# Altium project AD5541.PrjPcb
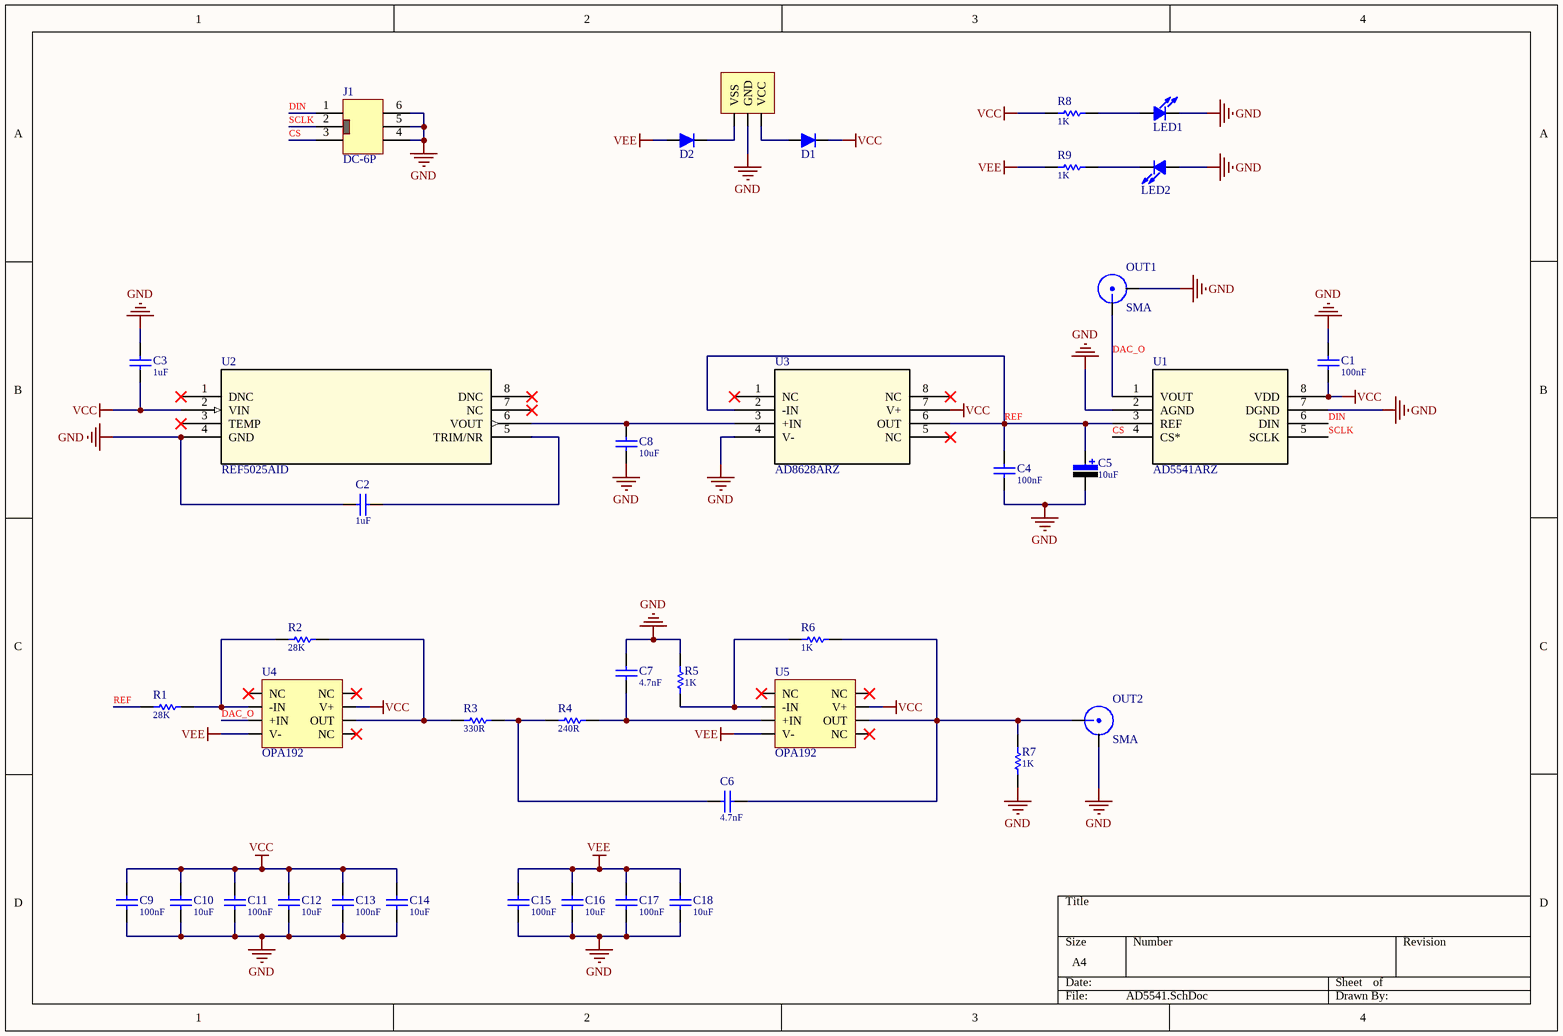
[diagram p0: AD5541.SchDoc]
1 sheet, 40 parts. Net scope: global (net labels, ports and power ports of the same name join across sheets).
Board file: AD5541.PcbDoc

## Sheet AD5541.SchDoc
size A4

### Parts
C1  value 100nF  [C0603-L]  (hidden comment: Cap-S)
C2  value 1uF  [C0603-L]  (hidden comment: Cap-S)
C3  value 1uF  [C0603-L]  (hidden comment: Cap-S)
C4  value 100nF  [C0603-L]  (hidden comment: Cap-S)
C5  value 10uF  [C-DIP-8]  (hidden comment: C)
C6  value 4.7nF  [C0603-L]  (hidden comment: Cap-S)
C7  value 4.7nF  [C0603-L]  (hidden comment: Cap-S)
C8  value 10uF  [C0603-L]  (hidden comment: Cap-S)
C9  value 100nF  [C0603-L]  (hidden comment: Cap-S)
C10  value 10uF  [C0603-L]  (hidden comment: Cap-S)
C11  value 100nF  [C0603-L]  (hidden comment: Cap-S)
C12  value 10uF  [C0603-L]  (hidden comment: Cap-S)
C13  value 100nF  [C0603-L]  (hidden comment: Cap-S)
C14  value 10uF  [C0603-L]  (hidden comment: Cap-S)
C15  value 100nF  [C0603-L]  (hidden comment: Cap-S)
C16  value 10uF  [C0603-L]  (hidden comment: Cap-S)
C17  value 100nF  [C0603-L]  (hidden comment: Cap-S)
C18  value 10uF  [C0603-L]  (hidden comment: Cap-S)
D1  D  [D-SMA]  (value not drawn)
D2  D  [D-SMA]  (value not drawn)
J1  DC-6P  [DC-6P]
J2  Power-3P  [SIPA03]  (value not drawn)
LED1  LED  [Led-0805_L]  (value not drawn)
LED2  LED  [Led-0805_L]  (value not drawn)
OUT1  SMA  [SMA1]
OUT2  SMA  [SMA1]
R1  value 28K  [R0603-L]  (hidden comment: R)
R2  value 28K  [R0603-L]  (hidden comment: R)
R3  value 330R  [R0603-L]  (hidden comment: R)
R4  value 240R  [R0603-L]  (hidden comment: R)
R5  value 1K  [R0603-L]  (hidden comment: R)
R6  value 1K  [R0603-L]  (hidden comment: R)
R7  value 1K  [R0603-L]  (hidden comment: R)
R8  value 1K  [R0603-L]  (hidden comment: R)
R9  value 1K  [R0603-L]  (hidden comment: R)
U1  AD5541ARZ  [R_8_ADI]
U2  REF5025AID  [D8]
U3  AD8628ARZ  [R_8_ADI]
U4  OPA192  [SOIC127P600X175-8N]
U5  OPA192  [SOIC127P600X175-8N]

### Nets
GND: C1.2 C2.1 C3.2 C4.1 C5.2 C7.2 C8.1 C9.1 C10.1 C11.1 C12.1 C13.1 C14.1 C15.1 C16.1 C17.1 C18.1 J1.4 J1.5 J1.6 J2.2(GND) LED1.2 LED2.1 OUT1.2 OUT2.2 R5.1 R7.1 U1.2(AGND) U1.7(DGND) U2.4(GND) U3.4(V-)
VCC: C1.1 C3.1 C9.2 C10.2 C11.2 C12.2 C13.2 C14.2 D1.2 R8.1 U1.8(VDD) U2.2(VIN) U3.7(V+) U4.7(V+) U5.7(V+)
VEE: C15.2 C16.2 C17.2 C18.2 D2.1 R9.1 U4.4(V-) U5.4(V-)
CS: J1.3 U1.4(CS*)
DAC_O: OUT1.1 U1.1(VOUT) U4.3(+IN)
DIN: J1.1 U1.6(DIN)
REF: C4.2 C5.1 R1.1 U1.3(REF) U3.2(-IN) U3.6(OUT)
SCLK: J1.2 U1.5(SCLK)
NetC2_2: C2.2 U2.5(TRIM/NR)
NetC6_1: C6.1 R3.2 R4.1
NetC6_2: C6.2 OUT2.1 R6.2 R7.2 U5.6(OUT)
NetC7_1: C7.1 R4.2 U5.3(+IN)
NetC8_2: C8.2 U2.6(VOUT) U3.3(+IN)
NetD1_1: D1.1 J2.1(VCC)
NetD2_2: D2.2 J2.3(VSS)
NetLED1_1: LED1.1 R8.2
NetLED2_2: LED2.2 R9.2
NetR1_2: R1.2 R2.1 U4.2(-IN)
NetR2_2: R2.2 R3.1 U4.6(OUT)
NetR5_2: R5.2 R6.1 U5.2(-IN)

Not connected (* = marked no-connect by the designer): U2 1(DNC)* 3(TEMP)* 7(NC)* 8(DNC)*; U3 1(NC)* 5(NC)* 8(NC)*; U4 1(NC)* 5(NC)* 8(NC)*; U5 1(NC)* 5(NC)* 8(NC)*

### Library data of the parts
C1-C4 C6-C18 = Cap-S: 贴片瓷片电容
C5 = Cap-Pol-ER: 极性直插电解电容
D1 D2 = Diode: 二极管
J2 = Power-3P: 供电端子
LED1 LED2 = LED: 发光二极管
R1-R9 = Res: 贴片电阻
U1 = AD5541ARZ: No Description Available; Mfr_Name: Analog Devices Inc; Copyright: Copyright (C) 2021 Ultra Librarian. All rights reserved.; Manufacturer_Part_Number: AD5541ARZ; RefDes: RefDes; Type: DEV
U2 = REF5025AID: No Description Available; Mfr_Name: Texas Instruments; Copyright: Copyright (C) 2021 Ultra Librarian. All rights reserved.; Manufacturer_Part_Number: REF5025AID; RefDes: RefDes; Type: DEV
U3 = AD8628ARZ: No Description Available; Mfr_Name: Analog Devices Inc; Copyright: Copyright (C) 2021 Ultra Librarian. All rights reserved.; Manufacturer_Part_Number: AD8628ARZ; RefDes: RefDes; Type: DEV